# Altium schematic sheet PCBBoardlayout.SchDoc
size A
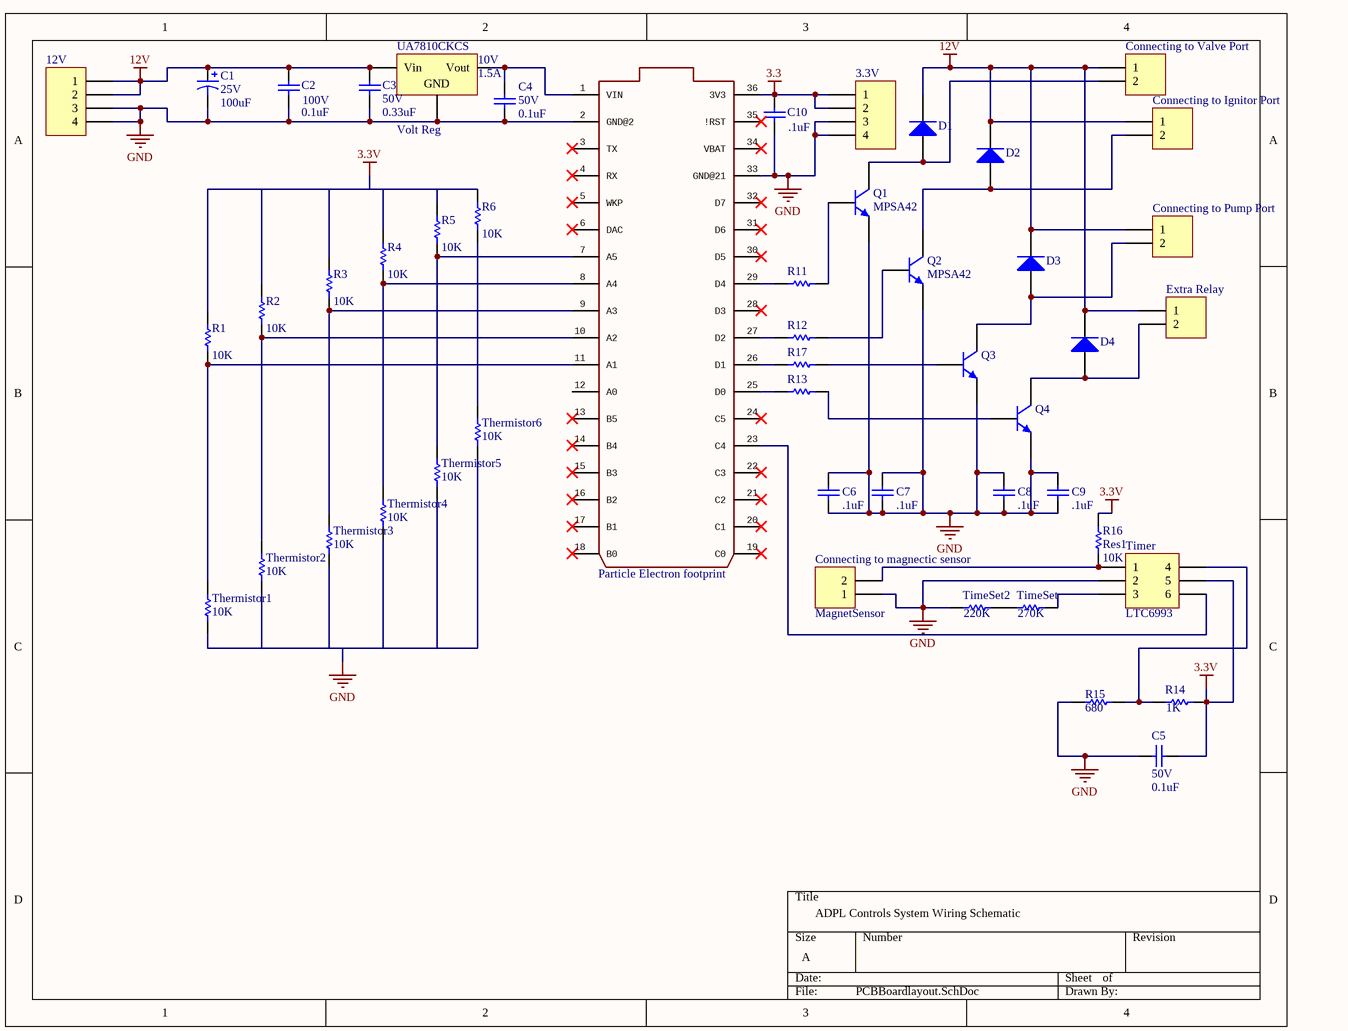
[diagram p0: PCBBoardlayout.SchDoc]

## Parts
3.3V  (no value)  [HDR1X4]
12V  (no value)  [HDR1X2]
C1  25V  value 100uF  [RB7.6-15]
C2  100V  value 0.1uF  [C1206]
C3  50V  value 0.33uF  [RAD-0.3]
C4  50V  value 0.1uF  [RAD-0.3]
C5  50V  value 0.1uF  [RAD-0.3]
C6  value .1uF  [C1206]  (hidden comment: BYCap)
C7  value .1uF  [C1206]  (hidden comment: BYCap)
C8  value .1uF  [C1206]  (hidden comment: BYCap)
C9  value .1uF  [C1206]  (hidden comment: BYCap)
C10  value .1uF  [C1206]  (hidden comment: BYCap)
Connecting_to_Ignitor_Port  (no value)  [HDR1X2]
Connecting_to_magnectic_sensor  MagnetSensor  [HDR1X2]
Connecting_to_Pump_Port  (no value)  [HDR1X2]
Connecting_to_Valve_Port  (no value)  [HDR1X2]
D1  Diode 1N914  [DO-35]  (value not drawn)
D2  Diode 1N914  [DO-35]  (value not drawn)
D3  Diode 1N914  [DO-35]  (value not drawn)
D4  Diode 1N914  [DO-35]  (value not drawn)
Extra_Relay  (no value)  [HDR1X2]
Photon  Particle Electron footprint  [ELECTRON]
Q1  MPSA42  [TO-92A]
Q2  MPSA42  [TO-92A]
Q3  (no value)  [TO-92A]
Q4  MPSA42  [TO-92A]  (value not drawn)
R1  value 10K  [AXIAL-0.3]  (hidden comment: Res1)
R2  value 10K  [AXIAL-0.3]  (hidden comment: Res1)
R3  value 10K  [AXIAL-0.3]  (hidden comment: Res1)
R4  value 10K  [AXIAL-0.3]  (hidden comment: Res1)
R5  value 10K  [AXIAL-0.3]  (hidden comment: Res1)
R6  value 10K  [AXIAL-0.3]  (hidden comment: Res1)
R11  Res1  [AXIAL-0.3]  (value not drawn)
R12  Res1  [AXIAL-0.3]  (value not drawn)
R13  Res1  [AXIAL-0.3]  (value not drawn)
R14  value 1K  [AXIAL-0.3]  (hidden comment: Res14)
R15  value 680  [AXIAL-0.3]  (hidden comment: Res1)
R16  Res1  value 10K  [AXIAL-0.3]
R17  Res1  [AXIAL-0.3]  (value not drawn)
Thermistor1  value 10K  [AXIAL-0.3]  (hidden comment: Res1)
Thermistor2  value 10K  [AXIAL-0.3]  (hidden comment: Res1)
Thermistor3  value 10K  [AXIAL-0.3]  (hidden comment: Res1)
Thermistor4  value 10K  [AXIAL-0.3]  (hidden comment: Res1)
Thermistor5  value 10K  [AXIAL-0.3]  (hidden comment: Res1)
Thermistor6  value 10K  [AXIAL-0.3]  (hidden comment: Res1)
Timer  LTC6993  [LTC6993]
TimeSet  value 270K  [AXIAL-0.3]  (hidden comment: Res1)
TimeSet2  value 220K  [AXIAL-0.3]  (hidden comment: Res1)
UA7810CKCS  Volt Reg  Voltage output: 10V  Current output: 1.5A  [D2PAK_N]

## Nets
3.3: 3.3V.1 3.3V.2 C10.2 Photon.36(3V3)
3.3V: C5.1 R14.1 R16.2 Timer.5
12V: 12V.1 12V.2 C1.1 C2.2 C3.2 Connecting_to_Ignitor_Port.1 Connecting_to_Pump_Port.1 Connecting_to_Valve_Port.1 D1.2(K) D2.2(K) D3.2(K) D4.2(K) Extra_Relay.1 UA7810CKCS.1(Vin)
GND: 3.3V.3 3.3V.4 12V.3 12V.4 C1.2 C2.1 C3.1 C4.1 C5.2 C6.1 C6.2 C7.1 C7.2 C8.1 C8.2 C9.1 C9.2 C10.1 Connecting_to_magnectic_sensor.1 Photon.2(GND@2) Photon.33(GND@21) Q1.1(E) Q2.1(E) Q3.1(E) Q4.1(E) R15.2 Timer.2 TimeSet2.1 UA7810CKCS.2(GND)
NetC4_2: C4.2 Photon.1(VIN) UA7810CKCS.3(Vout)
NetConnecting_to_Ignitor_Port_2: Connecting_to_Ignitor_Port.2 D2.1(A) Q2.3(C)
NetConnecting_to_magnectic_sensor_2: Connecting_to_magnectic_sensor.2 R16.1 Timer.1
NetConnecting_to_Pump_Port_2: Connecting_to_Pump_Port.2 D3.1(A) Q3.3(C)
NetConnecting_to_Valve_Port_2: Connecting_to_Valve_Port.2 D1.1(A) Q1.3(C)
NetD4_1: D4.1(A) Extra_Relay.2 Q4.3(C)
NetPhoton_7: Photon.7(A5) R5.1 Thermistor5.2
NetPhoton_8: Photon.8(A4) R4.1 Thermistor4.2
NetPhoton_9: Photon.9(A3) R3.1 Thermistor3.2
NetPhoton_10: Photon.10(A2) R2.1 Thermistor2.2
NetPhoton_11: Photon.11(A1) R1.1 Thermistor1.2
NetPhoton_23: Photon.23(C4) Timer.6
NetPhoton_25: Photon.25(D0) R13.1
NetPhoton_26: Photon.26(D1) R17.1
NetPhoton_27: Photon.27(D2) R12.1
NetPhoton_29: Photon.29(D4) R11.1
NetQ1_2: Q1.2(B) R11.2
NetQ2_2: Q2.2(B) R12.2
NetQ3_2: Q3.2(B) R17.2
NetQ4_2: Q4.2(B) R13.2
NetR6_1: R6.1 Thermistor6.2
NetR14_2: R14.2 R15.1 Timer.4
NetTimer_3: Timer.3 TimeSet.2
NetTimeSet_1: TimeSet.1 TimeSet2.2

Not connected (* = marked no-connect by the designer): Photon 3(TX)* 4(RX)* 5(WKP)* 6(DAC)* 12(A0) 13(B5)* 14(B4)* 15(B3)* 16(B2)* 17(B1)* 18(B0)* 19(C0)* 20(C1)* 21(C2)* 22(C3)* 24(C5)* 28(D3)* 30(D5)* 31(D6)* 32(D7)* 34(VBAT)* 35(!RST)*; R1 2; R2 2; R3 2; R4 2; R5 2; R6 2; Thermistor1 1; Thermistor2 1; Thermistor3 1; Thermistor4 1; Thermistor5 1; Thermistor6 1

## Notes on the sheet
- ADPL Controls System Wiring Schematic

## Library data of the parts
3.3V 12V = Header 4: Header, 4-Pin; LatestRevisionDate: 17-Jul-2002; LatestRevisionNote: Re-released for DXP Platform.; Publisher: Altium Limited
C1 = Cap Pol1: Polarized Capacitor (Radial); Published: 8-Jun-2000; LatestRevisionDate: 17-Jul-2002; LatestRevisionNote: Re-released for DXP Platform.; PackageReference: RB7.6-15; Publisher: Altium Limited; PackageDescription: Polarized Capacitor (Radial); 2 Leads
C2 C6-C10 = Cap Semi: Capacitor (Semiconductor SIM Model); Part#: 581-SA111E104MAR; Published: 8-Jun-2000; LatestRevisionDate: 29-May-2009; LatestRevisionNote: IPC-7351 Footprint Added.; PackageReference: C1206; Publisher: Altium Limited; PackageDescription: Chip Capacitor
C3 C4 = Cap: Capacitor; Published: 8-Jun-2000; LatestRevisionDate: 17-Jul-2002; LatestRevisionNote: Re-released for DXP Platform.; PackageReference: RAD-0.3; Publisher: Altium Limited; PackageDescription: Radial Cap, Thru-Hole; 2 Leads; 0.3 in Pin Spacing
C5 = cap: Capacitor; Published: 8-Jun-2000; LatestRevisionDate: 17-Jul-2002; LatestRevisionNote: Re-released for DXP Platform.; PackageReference: RAD-0.3; Publisher: Altium Limited; PackageDescription: Radial Cap, Thru-Hole; 2 Leads; 0.3 in Pin Spacing
Connecting_to_Ignitor_Port Connecting_to_Pump_Port Connecting_to_Valve_Port Extra_Relay = Header 2: Header, 2-Pin; LatestRevisionDate: 17-Jul-2002; LatestRevisionNote: Re-released for DXP Platform.; Publisher: Altium Limited
Connecting_to_magnectic_sensor = Header 2: Header, 2-Pin; Resistance: Contact on maximum resistance: ≤10kΩ   Open contact minimum resistance: ≥500kΩ; LatestRevisionDate: 17-Jul-2002; LatestRevisionNote: Re-released for DXP Platform.; Publisher: Altium Limited; Source: http://www.amazon.com/GERI-Counter-Digital-Proximity-Magnetic/dp/B01875612U/ref=sr_1_2?ie=UTF8&qid=1456764906&sr=8-2&keywords=magnetic+counter
D1-D4 = Diode 1N914: High Conductance Fast Diode; Published: 8-Jun-2000; LatestRevisionDate: 17-Jul-2002; LatestRevisionNote: Re-released for DXP Platform.; DatasheetVersion: 1997; PackageReference: DO-35; Publisher: Altium Limited; PackageDescription: Diode, Axial; Body 3.8 x 1.9 mm (LxDia. max), Lead Dia. 0.53 mm (max); Code_JEDEC: DO-204-AH; ComponentLink1Description: Manufacturer Link; ComponentLink1URL: http://www.fairchildsemi.com/; ComponentLink2Description: Datasheet; ComponentLink2URL: http://www.fairchildsemi.com/ds/1N%2F1N4448.pdf
Photon = ELECTRON_WITH_HEADERS
Q1-Q4 = 2N3904: NPN General Purpose Amplifier; Part#: 512-MPSA42; Published: 8-Jun-2000; LatestRevisionDate: 17-Jan-2003; LatestRevisionNote: PCB Footprint replaced; DatasheetVersion: 1997; PackageVersion: Sep-1998; PackageReference: TO-92A; Publisher: Altium Limited; PackageDescription: TO, Flat Index; 3 In-Line, Axial Leads; Body Dia. 4.5mm; Leads 0.51 x 0.48 mm (max); ComponentLink1Description: Manufacturer Link; ComponentLink1URL: http://www.fairchildsemi.com/; ComponentLink2Description: Datasheet; ComponentLink2URL: http://www.fairchildsemi.com/ds/2N%2F2N3904.pdf
R1-R6 R16 = Res1: Resistor; Published: 8-Jun-2000; LatestRevisionDate: 17-Jul-2002; LatestRevisionNote: Re-released for DXP Platform.; PackageReference: AXIAL-0.3; Publisher: Altium Limited; PackageDescription: Axial Device, Thru-Hole; 2 Leads; 0.3 in Pin Spacing
R11-R13 R17 = Res1: Resistor; Value: 10K; Published: 8-Jun-2000; LatestRevisionDate: 17-Jul-2002; LatestRevisionNote: Re-released for DXP Platform.; PackageReference: AXIAL-0.3; Publisher: Altium Limited; PackageDescription: Axial Device, Thru-Hole; 2 Leads; 0.3 in Pin Spacing
R14 = Res1: Resistor; Part#: 660-CF1/4C681J; Published: 8-Jun-2000; LatestRevisionDate: 17-Jul-2002; LatestRevisionNote: Re-released for DXP Platform.; PackageReference: AXIAL-0.3; Publisher: Altium Limited; PackageDescription: Axial Device, Thru-Hole; 2 Leads; 0.3 in Pin Spacing
R15 = Res1: Resistor; Part#: 660-CF1/4CT52R102J; Published: 8-Jun-2000; LatestRevisionDate: 17-Jul-2002; LatestRevisionNote: Re-released for DXP Platform.; PackageReference: AXIAL-0.3; Publisher: Altium Limited; PackageDescription: Axial Device, Thru-Hole; 2 Leads; 0.3 in Pin Spacing
Thermistor1 Thermistor2 Thermistor4-Thermistor6 = Res1: Resistor; Part#: NTCAIMME3C90373; Published: 8-Jun-2000; LatestRevisionDate: 17-Jul-2002; LatestRevisionNote: Re-released for DXP Platform.; PackageReference: AXIAL-0.3; Publisher: Altium Limited; PackageDescription: Axial Device, Thru-Hole; 2 Leads; 0.3 in Pin Spacing
Thermistor3 = Res1: Resistor; Part#: Dwyer I2-1B062; Published: 8-Jun-2000; LatestRevisionDate: 17-Jul-2002; LatestRevisionNote: Re-released for DXP Platform.; PackageReference: AXIAL-0.3; Publisher: Altium Limited; PackageDescription: Axial Device, Thru-Hole; 2 Leads; 0.3 in Pin Spacing
TimeSet = Res1: Resistor; Part#: 660-CF1/4CT52R274J; Published: 8-Jun-2000; LatestRevisionDate: 17-Jul-2002; LatestRevisionNote: Re-released for DXP Platform.; PackageReference: AXIAL-0.3; Publisher: Altium Limited; PackageDescription: Axial Device, Thru-Hole; 2 Leads; 0.3 in Pin Spacing
TimeSet2 = Res1: Resistor; Part#: 660-CF1/4CT52R224J; Published: 8-Jun-2000; LatestRevisionDate: 17-Jul-2002; LatestRevisionNote: Re-released for DXP Platform.; PackageReference: AXIAL-0.3; Publisher: Altium Limited; PackageDescription: Axial Device, Thru-Hole; 2 Leads; 0.3 in Pin Spacing
UA7810CKCS = Volt Reg: Voltage Regulator; Part#: UA7810CKCS; Voltage input: 12.5-28V; Published: 24-Mar-1999; LatestRevisionDate: 29-May-2009; LatestRevisionNote: IPC-7351 Footprint Added.; PackageReference: D2PAK; Publisher: Altium Limited; PackageDescription: 3-Pin Transistor Outline Package 2.54 mm Pitch, 15.1 mm Lead Span